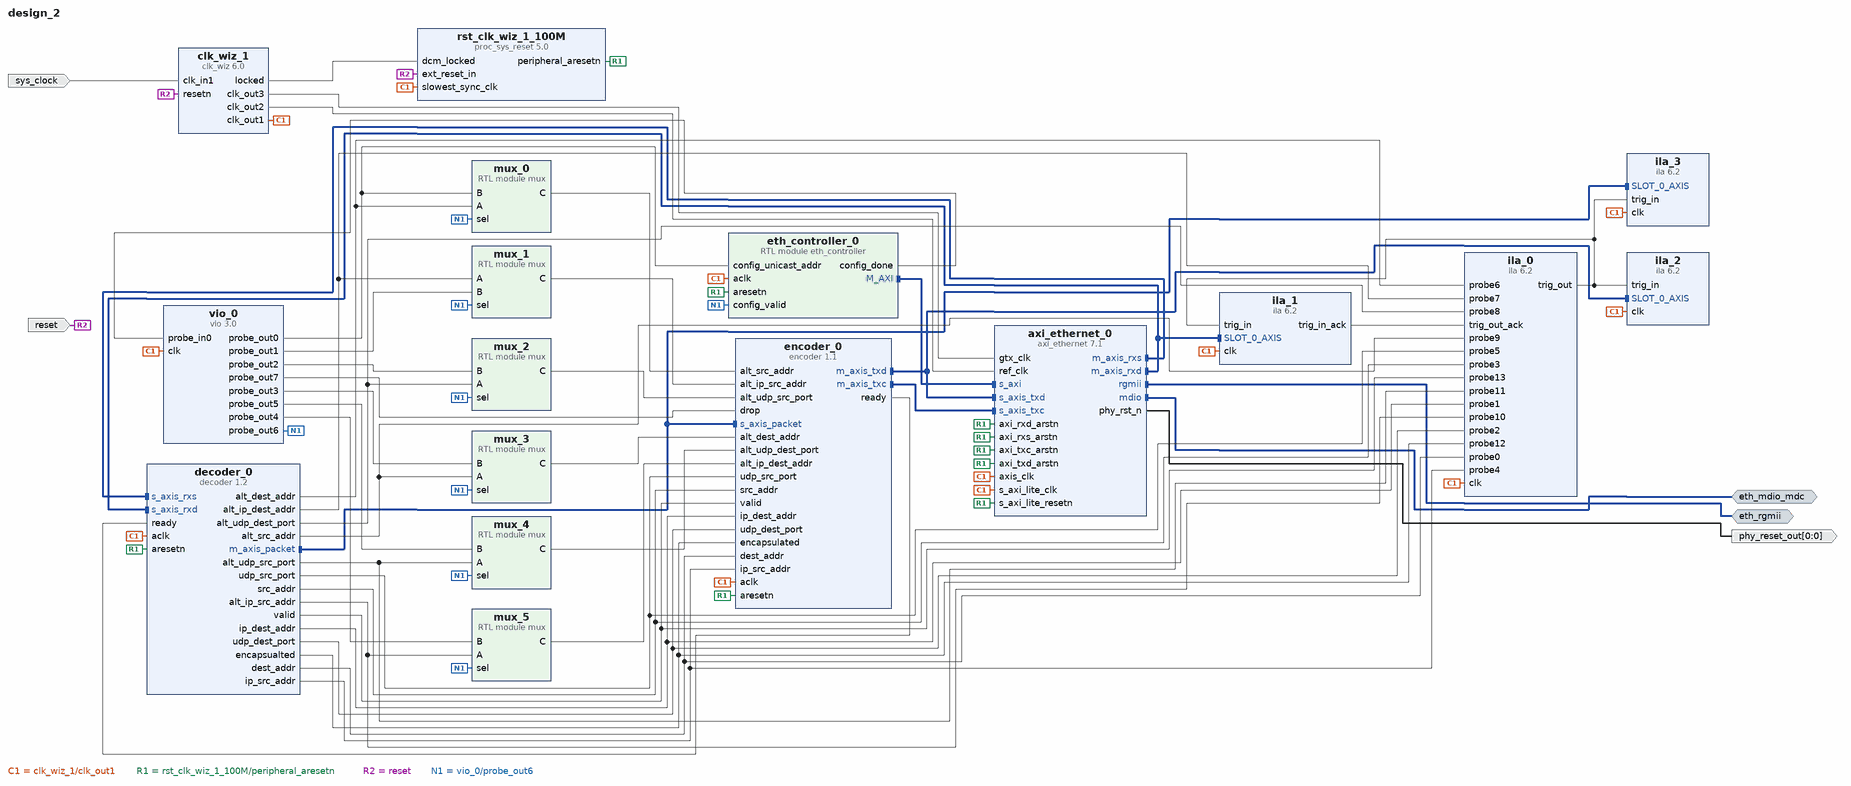
[diagram p0: block diagram of the top level]
# Vivado block design design_2, xc7a200tsbg484-1, Vivado 2018.3.1
create_bd_design design_2

create_bd_intf_port -mode Master -vlnv xilinx.com:interface:mdio_rtl:1.0 eth_mdio_mdc
create_bd_intf_port -mode Master -vlnv xilinx.com:interface:rgmii_rtl:1.0 eth_rgmii
create_bd_port -dir O -from 0 -to 0 -type rst phy_reset_out
create_bd_port -dir I -type rst reset
set_property -dict {CONFIG.POLARITY ACTIVE_LOW} [get_bd_ports reset]
create_bd_port -dir I -type clk sys_clock
set_property -dict {CONFIG.FREQ_HZ 100000000 CONFIG.PHASE 0.000} [get_bd_ports sys_clock]

create_bd_cell -type ip -vlnv xilinx.com:ip:axi_ethernet:7.1 axi_ethernet_0
set_property -dict [list \
  CONFIG.ETHERNET_BOARD_INTERFACE eth_rgmii \
  CONFIG.Frame_Filter false \
  CONFIG.MDIO_BOARD_INTERFACE eth_mdio_mdc \
  CONFIG.PHYRST_BOARD_INTERFACE phy_reset_out \
] [get_bd_cells axi_ethernet_0]
create_bd_cell -type ip -vlnv xilinx.com:ip:clk_wiz:6.0 clk_wiz_1
set_property -dict [list \
  CONFIG.CLKOUT2_JITTER 114.829 \
  CONFIG.CLKOUT2_PHASE_ERROR 98.575 \
  CONFIG.CLKOUT2_REQUESTED_OUT_FREQ 200.000 \
  CONFIG.CLKOUT2_USED true \
  CONFIG.CLKOUT3_JITTER 125.247 \
  CONFIG.CLKOUT3_PHASE_ERROR 98.575 \
  CONFIG.CLKOUT3_REQUESTED_OUT_FREQ 125.000 \
  CONFIG.CLKOUT3_USED true \
  CONFIG.CLK_IN1_BOARD_INTERFACE sys_clock \
  CONFIG.MMCM_CLKOUT1_DIVIDE 5 \
  CONFIG.MMCM_CLKOUT2_DIVIDE 8 \
  CONFIG.MMCM_DIVCLK_DIVIDE 1 \
  CONFIG.NUM_OUT_CLKS 3 \
  CONFIG.PRIM_SOURCE Single_ended_clock_capable_pin \
  CONFIG.RESET_BOARD_INTERFACE reset \
  CONFIG.RESET_PORT resetn \
  CONFIG.RESET_TYPE ACTIVE_LOW \
  CONFIG.USE_BOARD_FLOW true \
] [get_bd_cells clk_wiz_1]
create_bd_cell -type ip -vlnv xilinx.com:ip:proc_sys_reset:5.0 rst_clk_wiz_1_100M
set_property -dict {CONFIG.RESET_BOARD_INTERFACE reset CONFIG.USE_BOARD_FLOW true} [get_bd_cells rst_clk_wiz_1_100M]
create_bd_cell -type ip -vlnv xilinx.com:ip:vio:3.0 vio_0
set_property -dict [list \
  CONFIG.C_EN_PROBE_IN_ACTIVITY 1 \
  CONFIG.C_NUM_PROBE_IN 1 \
  CONFIG.C_NUM_PROBE_OUT 8 \
  CONFIG.C_PROBE_OUT0_WIDTH 48 \
  CONFIG.C_PROBE_OUT1_WIDTH 32 \
  CONFIG.C_PROBE_OUT2_WIDTH 16 \
  CONFIG.C_PROBE_OUT3_WIDTH 48 \
  CONFIG.C_PROBE_OUT4_WIDTH 32 \
  CONFIG.C_PROBE_OUT5_WIDTH 16 \
] [get_bd_cells vio_0]
create_bd_cell -type ip -vlnv xilinx.com:ip:ila:6.2 ila_0
set_property -dict [list \
  CONFIG.ALL_PROBE_SAME_MU_CNT 1 \
  CONFIG.C_ENABLE_ILA_AXI_MON false \
  CONFIG.C_MONITOR_TYPE Native \
  CONFIG.C_NUM_OF_PROBES 14 \
  CONFIG.C_PROBE0_MU_CNT 1 \
  CONFIG.C_PROBE10_MU_CNT 1 \
  CONFIG.C_PROBE10_WIDTH 32 \
  CONFIG.C_PROBE11_MU_CNT 1 \
  CONFIG.C_PROBE12_MU_CNT 1 \
  CONFIG.C_PROBE12_WIDTH 1 \
  CONFIG.C_PROBE13_MU_CNT 1 \
  CONFIG.C_PROBE13_WIDTH 1 \
  CONFIG.C_PROBE14_WIDTH 1 \
  CONFIG.C_PROBE15_WIDTH 1 \
  CONFIG.C_PROBE16_WIDTH 1 \
  CONFIG.C_PROBE17_WIDTH 1 \
  CONFIG.C_PROBE18_WIDTH 1 \
  CONFIG.C_PROBE19_WIDTH 1 \
  CONFIG.C_PROBE1_MU_CNT 1 \
  CONFIG.C_PROBE1_WIDTH 32 \
  CONFIG.C_PROBE2_MU_CNT 1 \
  CONFIG.C_PROBE2_WIDTH 16 \
  CONFIG.C_PROBE3_MU_CNT 1 \
  CONFIG.C_PROBE3_WIDTH 48 \
  CONFIG.C_PROBE4_MU_CNT 1 \
  CONFIG.C_PROBE4_WIDTH 32 \
  CONFIG.C_PROBE5_MU_CNT 1 \
  CONFIG.C_PROBE6_MU_CNT 1 \
  CONFIG.C_PROBE7_MU_CNT 1 \
  CONFIG.C_PROBE7_WIDTH 32 \
  CONFIG.C_PROBE8_MU_CNT 1 \
  CONFIG.C_PROBE8_WIDTH 16 \
  CONFIG.C_PROBE9_MU_CNT 1 \
  CONFIG.C_PROBE9_WIDTH 48 \
  CONFIG.C_SLOT_0_AXI_PROTOCOL AXI4S \
  CONFIG.C_TRIGOUT_EN true \
] [get_bd_cells ila_0]
create_bd_cell -type ip -vlnv xilinx.com:ip:ila:6.2 ila_1
set_property -dict [list \
  CONFIG.C_NUM_OF_PROBES 9 \
  CONFIG.C_SLOT_0_AXI_PROTOCOL AXI4S \
  CONFIG.C_TRIGIN_EN true \
  CONFIG.C_TRIGOUT_EN false \
] [get_bd_cells ila_1]
create_bd_cell -type ip -vlnv xilinx.com:ip:ila:6.2 ila_2
set_property -dict {CONFIG.C_NUM_OF_PROBES 9 CONFIG.C_SLOT_0_AXI_PROTOCOL AXI4S CONFIG.C_TRIGIN_EN true} [get_bd_cells ila_2]
create_bd_cell -type ip -vlnv xilinx.com:ip:ila:6.2 ila_3
set_property -dict {CONFIG.C_NUM_OF_PROBES 9 CONFIG.C_SLOT_0_AXI_PROTOCOL AXI4S CONFIG.C_TRIGIN_EN true} [get_bd_cells ila_3]
create_bd_cell -type module -reference mux mux_0
set_property -dict {CONFIG.WIDTH 48} [get_bd_cells mux_0]
create_bd_cell -type module -reference mux mux_1
set_property -dict {CONFIG.WIDTH 32} [get_bd_cells mux_1]
create_bd_cell -type module -reference mux mux_2
set_property -dict {CONFIG.WIDTH 16} [get_bd_cells mux_2]
create_bd_cell -type module -reference mux mux_3
set_property -dict {CONFIG.WIDTH 48} [get_bd_cells mux_3]
create_bd_cell -type module -reference mux mux_5
set_property -dict {CONFIG.WIDTH 32} [get_bd_cells mux_5]
create_bd_cell -type module -reference mux mux_4
set_property -dict {CONFIG.WIDTH 16} [get_bd_cells mux_4]
create_bd_cell -type module -reference eth_controller eth_controller_0
create_bd_cell -type ip -vlnv utoronto.ca:user:encoder:1.1 encoder_0
create_bd_cell -type ip -vlnv utoronto.ca:user:decoder:1.2 decoder_0

# ---- connections ----

connect_bd_intf_net [get_bd_intf_ports eth_rgmii] [get_bd_intf_pins axi_ethernet_0/rgmii]
connect_bd_intf_net [get_bd_intf_pins decoder_0/m_axis_packet] [get_bd_intf_pins encoder_0/s_axis_packet]
connect_bd_intf_net [get_bd_intf_pins decoder_0/m_axis_packet] [get_bd_intf_pins ila_3/SLOT_0_AXIS]
connect_bd_intf_net [get_bd_intf_pins decoder_0/s_axis_rxs] [get_bd_intf_pins axi_ethernet_0/m_axis_rxs]
connect_bd_intf_net [get_bd_intf_pins decoder_0/s_axis_rxd] [get_bd_intf_pins axi_ethernet_0/m_axis_rxd]
connect_bd_intf_net [get_bd_intf_pins decoder_0/s_axis_rxd] [get_bd_intf_pins ila_1/SLOT_0_AXIS]
connect_bd_intf_net [get_bd_intf_pins encoder_0/m_axis_txc] [get_bd_intf_pins axi_ethernet_0/s_axis_txc]
connect_bd_intf_net [get_bd_intf_pins encoder_0/m_axis_txd] [get_bd_intf_pins axi_ethernet_0/s_axis_txd]
connect_bd_intf_net [get_bd_intf_pins encoder_0/m_axis_txd] [get_bd_intf_pins ila_2/SLOT_0_AXIS]
connect_bd_intf_net [get_bd_intf_ports eth_mdio_mdc] [get_bd_intf_pins axi_ethernet_0/mdio]
connect_bd_intf_net [get_bd_intf_pins eth_controller_0/M_AXI] [get_bd_intf_pins axi_ethernet_0/s_axi]
connect_bd_net [get_bd_pins clk_wiz_1/clk_out1] \
  [get_bd_pins axi_ethernet_0/s_axi_lite_clk] [get_bd_pins rst_clk_wiz_1_100M/slowest_sync_clk] \
  [get_bd_pins axi_ethernet_0/axis_clk] [get_bd_pins vio_0/clk] [get_bd_pins ila_0/clk] [get_bd_pins ila_1/clk] \
  [get_bd_pins ila_2/clk] [get_bd_pins ila_3/clk] [get_bd_pins eth_controller_0/aclk] [get_bd_pins encoder_0/aclk] \
  [get_bd_pins decoder_0/aclk]
connect_bd_net [get_bd_pins rst_clk_wiz_1_100M/peripheral_aresetn] \
  [get_bd_pins axi_ethernet_0/s_axi_lite_resetn] [get_bd_pins axi_ethernet_0/axi_txd_arstn] \
  [get_bd_pins axi_ethernet_0/axi_txc_arstn] [get_bd_pins axi_ethernet_0/axi_rxd_arstn] \
  [get_bd_pins axi_ethernet_0/axi_rxs_arstn] [get_bd_pins eth_controller_0/aresetn] [get_bd_pins encoder_0/aresetn] \
  [get_bd_pins decoder_0/aresetn]
connect_bd_net [get_bd_pins clk_wiz_1/locked] [get_bd_pins rst_clk_wiz_1_100M/dcm_locked]
connect_bd_net [get_bd_pins clk_wiz_1/clk_out3] [get_bd_pins axi_ethernet_0/gtx_clk]
connect_bd_net [get_bd_pins axi_ethernet_0/phy_rst_n] [get_bd_ports phy_reset_out]
connect_bd_net [get_bd_ports reset] [get_bd_pins clk_wiz_1/resetn] [get_bd_pins rst_clk_wiz_1_100M/ext_reset_in]
connect_bd_net [get_bd_ports sys_clock] [get_bd_pins clk_wiz_1/clk_in1]
connect_bd_net [get_bd_pins clk_wiz_1/clk_out2] [get_bd_pins axi_ethernet_0/ref_clk]
connect_bd_net -net decoder_0_alt_dest_addr [get_bd_pins decoder_0/alt_dest_addr] [get_bd_pins mux_0/A] [get_bd_pins ila_0/probe6]
connect_bd_net -net decoder_0_alt_src_addr [get_bd_pins decoder_0/alt_src_addr] [get_bd_pins mux_3/A] [get_bd_pins ila_0/probe9]
connect_bd_net -net decoder_0_alt_udp_dest_port [get_bd_pins decoder_0/alt_udp_dest_port] [get_bd_pins mux_2/A] [get_bd_pins ila_0/probe8]
connect_bd_net -net decoder_0_alt_udp_src_port [get_bd_pins decoder_0/alt_udp_src_port] [get_bd_pins mux_4/A] [get_bd_pins ila_0/probe11]
connect_bd_net -net decoder_0_alt_ip_dest_addr [get_bd_pins decoder_0/alt_ip_dest_addr] [get_bd_pins mux_1/A] [get_bd_pins ila_0/probe7]
connect_bd_net -net decoder_0_alt_ip_src_addr [get_bd_pins decoder_0/alt_ip_src_addr] [get_bd_pins mux_5/A] [get_bd_pins ila_0/probe10]
connect_bd_net -net decoder_0_udp_src_port [get_bd_pins decoder_0/udp_src_port] [get_bd_pins ila_0/probe5] [get_bd_pins encoder_0/udp_src_port]
connect_bd_net -net decoder_0_src_addr [get_bd_pins decoder_0/src_addr] [get_bd_pins ila_0/probe3] [get_bd_pins encoder_0/src_addr]
connect_bd_net -net decoder_0_valid [get_bd_pins decoder_0/valid] [get_bd_pins ila_0/probe13] [get_bd_pins encoder_0/valid]
connect_bd_net -net decoder_0_ip_dest_addr [get_bd_pins decoder_0/ip_dest_addr] [get_bd_pins ila_0/probe1] [get_bd_pins encoder_0/ip_dest_addr]
connect_bd_net -net decoder_0_udp_dest_port [get_bd_pins decoder_0/udp_dest_port] [get_bd_pins ila_0/probe2] [get_bd_pins encoder_0/udp_dest_port]
connect_bd_net -net decoder_0_encapsualted [get_bd_pins decoder_0/encapsualted] [get_bd_pins ila_0/probe12] [get_bd_pins encoder_0/encapsulated]
connect_bd_net [get_bd_pins encoder_0/ready] [get_bd_pins decoder_0/ready]
connect_bd_net -net decoder_0_dest_addr [get_bd_pins decoder_0/dest_addr] [get_bd_pins ila_0/probe0] [get_bd_pins encoder_0/dest_addr]
connect_bd_net [get_bd_pins ila_0/trig_out] [get_bd_pins ila_3/trig_in] [get_bd_pins ila_2/trig_in] [get_bd_pins ila_1/trig_in]
connect_bd_net [get_bd_pins ila_1/trig_in_ack] [get_bd_pins ila_0/trig_out_ack]
connect_bd_net [get_bd_pins eth_controller_0/config_done] [get_bd_pins vio_0/probe_in0]
connect_bd_net -net mux_0_out [get_bd_pins mux_0/C] [get_bd_pins encoder_0/alt_src_addr]
connect_bd_net -net mux_1_out [get_bd_pins mux_1/C] [get_bd_pins encoder_0/alt_ip_src_addr]
connect_bd_net -net mux_2_out [get_bd_pins mux_2/C] [get_bd_pins encoder_0/alt_udp_src_port]
connect_bd_net -net src_addr [get_bd_pins vio_0/probe_out0] [get_bd_pins mux_0/B] [get_bd_pins eth_controller_0/config_unicast_addr]
connect_bd_net -net config_ready [get_bd_pins vio_0/probe_out6] \
  [get_bd_pins mux_3/sel] [get_bd_pins mux_1/sel] [get_bd_pins mux_5/sel] [get_bd_pins mux_2/sel] [get_bd_pins mux_4/sel] \
  [get_bd_pins mux_0/sel] [get_bd_pins eth_controller_0/config_valid]
connect_bd_net -net drop_packets [get_bd_pins vio_0/probe_out7] [get_bd_pins encoder_0/drop]
connect_bd_net [get_bd_pins mux_3/C] [get_bd_pins encoder_0/alt_dest_addr]
connect_bd_net [get_bd_pins mux_5/C] [get_bd_pins encoder_0/alt_ip_dest_addr]
connect_bd_net [get_bd_pins mux_4/C] [get_bd_pins encoder_0/alt_udp_dest_port]
connect_bd_net -net decoder_0_ip_src_addr [get_bd_pins decoder_0/ip_src_addr] [get_bd_pins ila_0/probe4] [get_bd_pins encoder_0/ip_src_addr]
connect_bd_net -net dest_udp_port [get_bd_pins vio_0/probe_out5] [get_bd_pins mux_4/B]
connect_bd_net -net src_ip_addr [get_bd_pins vio_0/probe_out1] [get_bd_pins mux_1/B]
connect_bd_net -net src_udp_port [get_bd_pins vio_0/probe_out2] [get_bd_pins mux_2/B]
connect_bd_net -net dest_addr [get_bd_pins vio_0/probe_out3] [get_bd_pins mux_3/B]
connect_bd_net -net dest_ip_addr [get_bd_pins vio_0/probe_out4] [get_bd_pins mux_5/B]
set_property HDL_ATTRIBUTE.DEBUG true [get_bd_nets decoder_0_alt_dest_addr]
set_property HDL_ATTRIBUTE.MARK_DEBUG true [get_bd_nets decoder_0_alt_dest_addr]
set_property HDL_ATTRIBUTE.DEBUG true [get_bd_nets decoder_0_alt_src_addr]
set_property HDL_ATTRIBUTE.MARK_DEBUG true [get_bd_nets decoder_0_alt_src_addr]
set_property HDL_ATTRIBUTE.DEBUG true [get_bd_nets decoder_0_alt_udp_dest_port]
set_property HDL_ATTRIBUTE.MARK_DEBUG true [get_bd_nets decoder_0_alt_udp_dest_port]
set_property HDL_ATTRIBUTE.DEBUG true [get_bd_nets decoder_0_alt_udp_src_port]
set_property HDL_ATTRIBUTE.MARK_DEBUG true [get_bd_nets decoder_0_alt_udp_src_port]
set_property HDL_ATTRIBUTE.DEBUG true [get_bd_nets decoder_0_alt_ip_dest_addr]
set_property HDL_ATTRIBUTE.MARK_DEBUG true [get_bd_nets decoder_0_alt_ip_dest_addr]
set_property HDL_ATTRIBUTE.DEBUG true [get_bd_nets decoder_0_alt_ip_src_addr]
set_property HDL_ATTRIBUTE.MARK_DEBUG true [get_bd_nets decoder_0_alt_ip_src_addr]
set_property HDL_ATTRIBUTE.DEBUG true [get_bd_nets decoder_0_udp_src_port]
set_property HDL_ATTRIBUTE.MARK_DEBUG true [get_bd_nets decoder_0_udp_src_port]
set_property HDL_ATTRIBUTE.DEBUG true [get_bd_nets decoder_0_src_addr]
set_property HDL_ATTRIBUTE.MARK_DEBUG true [get_bd_nets decoder_0_src_addr]
set_property HDL_ATTRIBUTE.DEBUG true [get_bd_nets decoder_0_valid]
set_property HDL_ATTRIBUTE.MARK_DEBUG true [get_bd_nets decoder_0_valid]
set_property HDL_ATTRIBUTE.DEBUG true [get_bd_nets decoder_0_ip_dest_addr]
set_property HDL_ATTRIBUTE.MARK_DEBUG true [get_bd_nets decoder_0_ip_dest_addr]
set_property HDL_ATTRIBUTE.DEBUG true [get_bd_nets decoder_0_udp_dest_port]
set_property HDL_ATTRIBUTE.MARK_DEBUG true [get_bd_nets decoder_0_udp_dest_port]
set_property HDL_ATTRIBUTE.DEBUG true [get_bd_nets decoder_0_encapsualted]
set_property HDL_ATTRIBUTE.MARK_DEBUG true [get_bd_nets decoder_0_encapsualted]
set_property HDL_ATTRIBUTE.DEBUG true [get_bd_nets decoder_0_dest_addr]
set_property HDL_ATTRIBUTE.MARK_DEBUG true [get_bd_nets decoder_0_dest_addr]
set_property HDL_ATTRIBUTE.DEBUG true [get_bd_nets decoder_0_ip_src_addr]
set_property HDL_ATTRIBUTE.MARK_DEBUG true [get_bd_nets decoder_0_ip_src_addr]

# ---- address map ----
assign_bd_address -offset 0x40C00000 -range 256K -target_address_space [get_bd_addr_spaces eth_controller_0/M_AXI] [get_bd_addr_segs axi_ethernet_0/s_axi/Reg0]

validate_bd_design
save_bd_design
